# Altium project Aud.PrjPcb
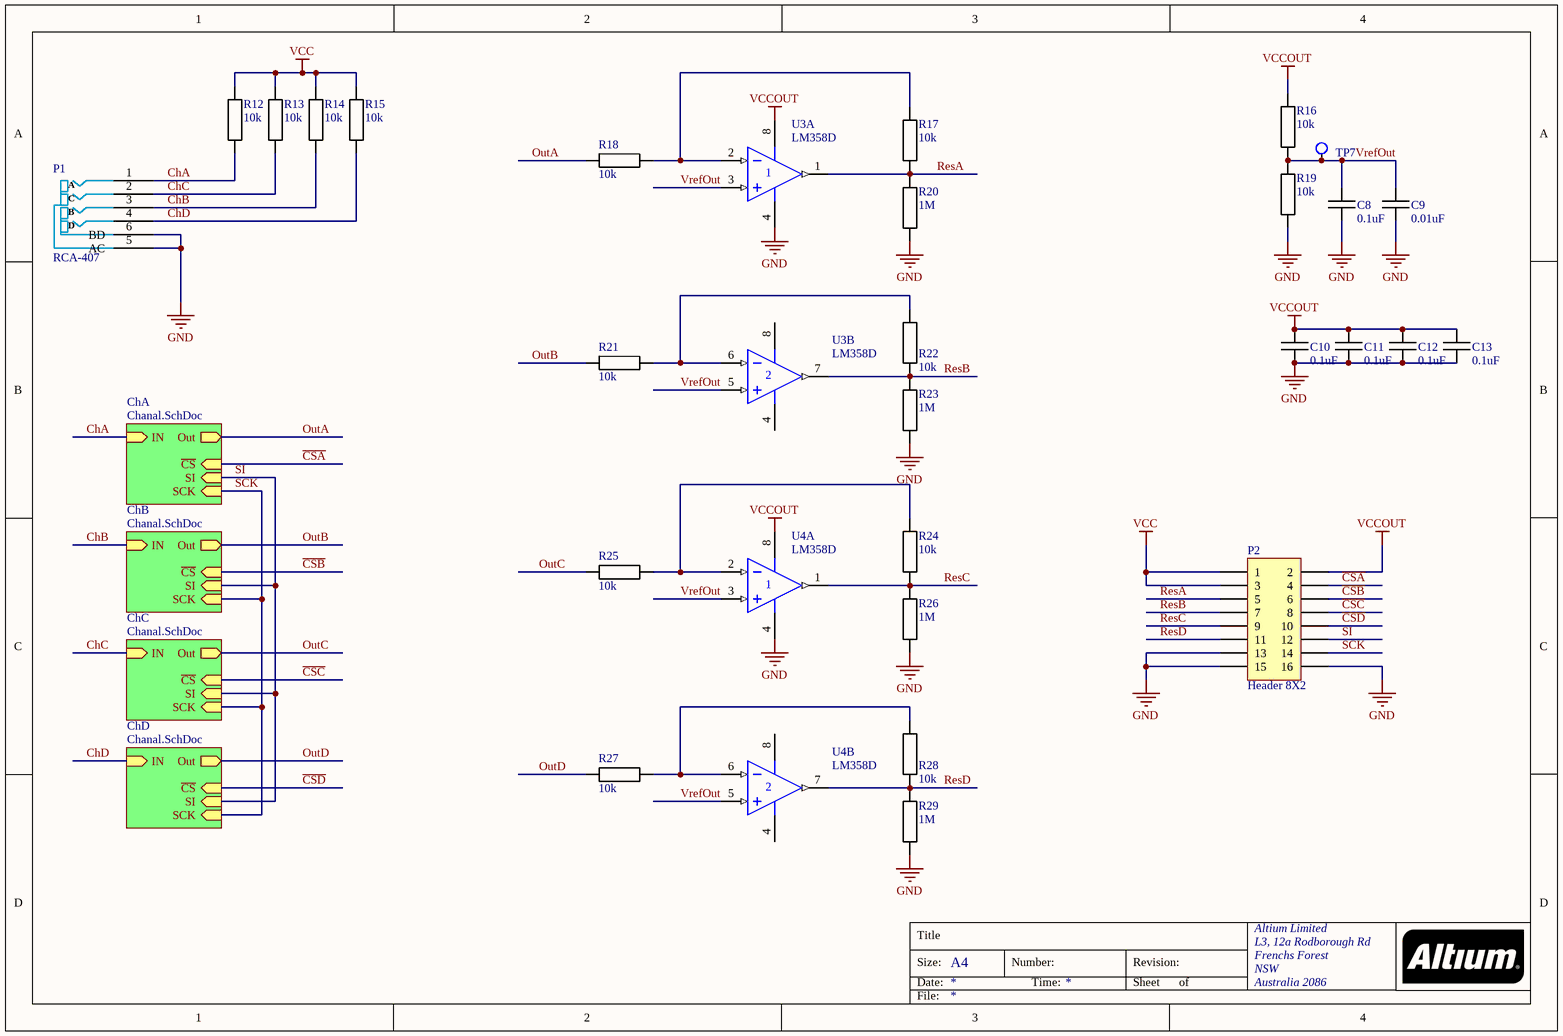
[diagram p0: Input.SchDoc]
2 sheets, 133 parts. Net scope: hierarchical (ports join the sheet entries above them; power ports are global).
Board file: AudRevA.PcbDoc
Sheets:
  Input.SchDoc
    ChA = Chanal.SchDoc
    ChB = Chanal.SchDoc
    ChC = Chanal.SchDoc
    ChD = Chanal.SchDoc

## Sheet Input.SchDoc
size A4; Organization: Altium Limited; Address1: L3, 12a Rodborough Rd; Address2: Frenchs Forest; Address3: NSW; Address4: Australia 2086

### Parts
C8  0.1uF  [SMD 0603]
C9  0.01uF  [SMD 0603]
C10  0.1uF  [SMD 0603]
C11  0.1uF  [SMD 0603]
C12  0.1uF  [SMD 0603]
C13  0.1uF  [SMD 0603]
P1  RCA-407  [RCA4]
P2  Header 8X2  [HDR2X8]
R12  10k  [SMD 0603]
R13  10k  [SMD 0603]
R14  10k  [SMD 0603]
R15  10k  [SMD 0603]
R16  10k  [SMD 0603]
R17  10k  [SMD 0603]
R18  10k  [SMD 0603]
R19  10k  [SMD 0603]
R20  1M  [SMD 0603]
R21  10k  [SMD 0603]
R22  10k  [SMD 0603]
R23  1M  [SMD 0603]
R24  10k  [SMD 0603]
R25  10k  [SMD 0603]
R26  1M  [SMD 0603]
R27  10k  [SMD 0603]
R28  10k  [SMD 0603]
R29  1M  [SMD 0603]
TP7  testPoint  [TESTPOINT]  (value not drawn)
U3  LM358D  [751-02_N]  (parts A,B of 2)
U4  LM358D  [751-02_N]  (parts A,B of 2)

### Sub-sheets
ChA = Chanal.SchDoc: ~{CS} (in), SCK (in), SI (in), IN (in), Out (out)
ChB = Chanal.SchDoc: ~{CS} (in), SCK (in), SI (in), IN (in), Out (out)
ChC = Chanal.SchDoc: ~{CS} (in), SCK (in), SI (in), IN (in), Out (out)
ChD = Chanal.SchDoc: ~{CS} (in), SCK (in), SI (in), IN (in), Out (out)

### Nets
GND: C8.2 C9.2 C10.2 C11.2 C12.2 C13.2 P1.5(AC) P1.6(BD) P2.13 P2.15 P2.16 R19.1 R20.2 R23.2 R26.2 R29.2 U3.4(V-) U4.4(V-)
VCC: P2.1 P2.3 R12.2 R13.2 R14.2 R15.2
VCCOUT: C10.1 C11.1 C12.1 C13.1 P2.2 R16.2 U3.8(V+) U4.8(V+)
~{CSA}: P2.4 ; sheet ChA/~{CS}  [project net ~{CS}]
~{CSB}: P2.6 ; sheet ChB/~{CS}  [project net ~{CS}]
~{CSC}: P2.8 ; sheet ChC/~{CS}  [project net ~{CS}]
~{CSD}: P2.10 ; sheet ChD/~{CS}  [project net ~{CS}]
ChA: P1.1(A) R12.1 ; sheet ChA/IN
ChB: P1.3(B) R14.1 ; sheet ChB/IN
ChC: P1.2(C) R13.1 ; sheet ChC/IN
ChD: P1.4(D) R15.1 ; sheet ChD/IN
OutA: R18.2 ; sheet ChA/Out
OutB: R21.2 ; sheet ChB/Out
OutC: R25.2 ; sheet ChC/Out
OutD: R27.2 ; sheet ChD/Out
ResA: P2.5 R17.2 R20.1 U3.1(OUT)
ResB: P2.7 R22.2 R23.1 U3.7(OUT)
ResC: P2.9 R24.2 R26.1 U4.1(OUT)
ResD: P2.11 R28.2 R29.1 U4.7(OUT)
SCK: P2.14 ; sheet ChA/SCK, sheet ChB/SCK, sheet ChC/SCK, sheet ChD/SCK
SI: P2.12 ; sheet ChA/SI, sheet ChB/SI, sheet ChC/SI, sheet ChD/SI
VrefOut: C8.1 C9.1 R16.1 R19.2 TP7.0 U3.3(IN+) U3.5(IN+) U4.3(IN+) U4.5(IN+)
NetR17_1: R17.1 R18.1 U3.2(IN-)
NetR21_1: R21.1 R22.1 U3.6(IN-)
NetR24_1: R24.1 R25.1 U4.2(IN-)
NetR27_1: R27.1 R28.1 U4.6(IN-)

### Notes on the sheet
- Title
- Size:
- Date:
- A4
- Number:
- Time:
- Revision:
- Sheet
- of
- File:

### Library data of the parts
C8-C13 = Capasitor
  C8 C10-C13: Value: 0.1uF
  C9: Value: 0.01uF
P1 = RCA-407: RCA 2x2
P2 = Header 8X2: Header, 8-Pin, Dual row; LatestRevisionDate: 17-Jul-2002; LatestRevisionNote: Re-released for DXP Platform.; Publisher: Altium Limited
R12-R29 = Resistor
  R12-R19 R21 R22 R24 R25 R27 R28: Value: 10k
  R20 R23 R26 R29: Value: 1M
U3 U4 = LM358D: Dual Low-Power Operational Amplifier; Published: 17-Jul-2002; LatestRevisionDate: 13-Apr-2006; LatestRevisionNote: IPC-7351 Footprint Added.; DatasheetVersion: 1988; PackageReference: 751-02; Publisher: Altium Limited; PackageDescription: 8-Pin Small Outline Integrated Circuit 1.27 mm Pitch; Code_JEDEC: MS-012-AA; Code_IPC: SOIC127P600-8; ComponentLink1Description: Manufacturer Link; ComponentLink1URL: http://www.onsemi.com/site/products/parametrics/0,4446,251,00.html; ComponentLink2Description: Datasheet; ComponentLink2URL: http://www.onsemi.com/pub/Collateral/LM358-D.PDF

## Sheet Chanal.SchDoc
size A4; Organization: Altium Limited; Address1: L3, 12a Rodborough Rd; Address2: Frenchs Forest; Address3: NSW; Address4: Australia 2086
Used 4 times, as channels ChA, ChB, ChC, ChD. Parts and nets are listed once, with the designators drawn on the sheet.
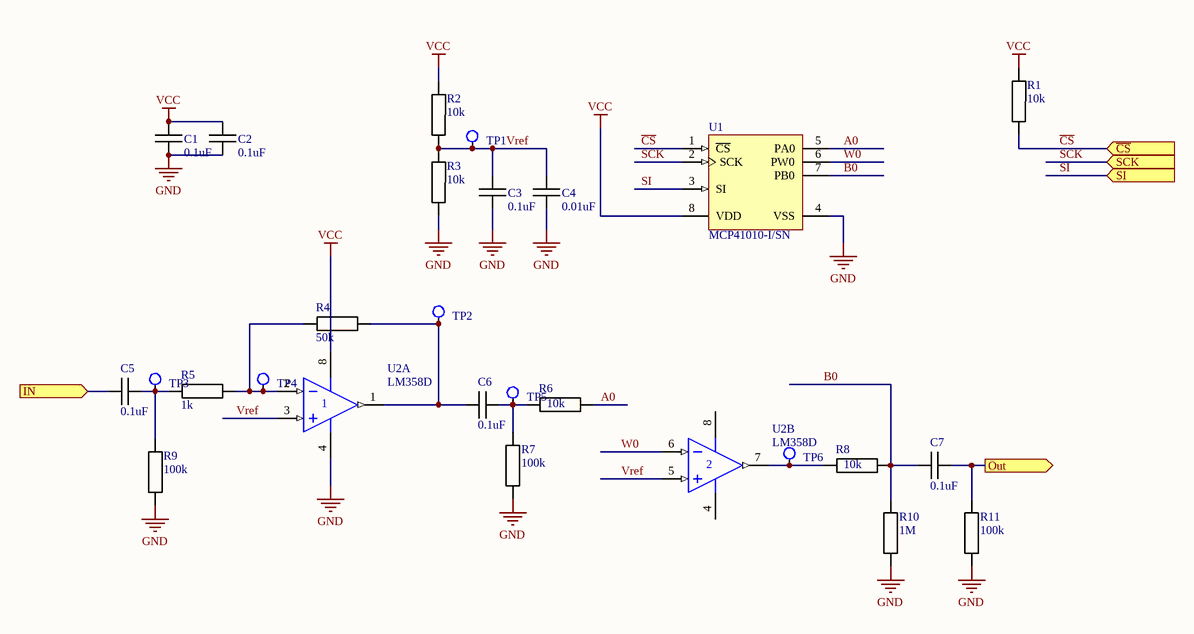
[diagram p1: Chanal.SchDoc]

### Parts
C1  0.1uF  [SMD 0603]
C2  0.1uF  [SMD 0603]
C3  0.1uF  [SMD 0603]
C4  0.01uF  [SMD 0603]
C5  0.1uF  [SMD 0603]
C6  0.1uF  [SMD 0603]
C7  0.1uF  [SMD 0603]
R1  10k  [SMD 0603]
R2  10k  [SMD 0603]
R3  10k  [SMD 0603]
R4  50k  [SMD 0603]
R5  1k  [SMD 0603]
R6  10k  [SMD 0603]
R7  100k  [SMD 0603]
R8  10k  [SMD 0603]
R9  100k  [SMD 0603]
R10  1M  [SMD 0603]
R11  100k  [SMD 0603]
TP1  testPoint  [TESTPOINT]  (value not drawn)
TP2  testPoint  [TESTPOINT]  (value not drawn)
TP3  testPoint  [TESTPOINT]  (value not drawn)
TP4  testPoint  [TESTPOINT]  (value not drawn)
TP5  testPoint  [TESTPOINT]  (value not drawn)
TP6  testPoint  [TESTPOINT]  (value not drawn)
U1  MCP41010-I/SN  [SOIC-SN8_N]
U2  LM358D  [751-02_N]  (parts A,B of 2)

### Ports
IN (in), Out (out), SCK (in), SI (in), ~{CS} (in)

### Nets
GND: C1.2 C2.2 C3.2 C4.2 R3.1 R7.2 R9.2 R10.2 R11.2 U1.4(VSS) U2.4(V-)
VCC: C1.1 C2.1 R1.2 R2.2 U1.8(VDD) U2.8(V+)
~{CS}: R1.1 U1.1(~{CS}) ; port ~{CS}
A0: R6.1 U1.5(PA0)
B0: C7.1 R8.1 R10.1 U1.7(PB0)
IN: C5.1 ; port IN
Out: C7.2 R11.1 ; port Out
SCK: U1.2(SCK) ; port SCK
SI: U1.3(SI) ; port SI
Vref: C3.1 C4.1 R2.1 R3.2 TP1.0 U2.3(IN+) U2.5(IN+)
W0: U1.6(PW0) U2.6(IN-)
NetC5_2: C5.2 R5.2 R9.1 TP3.0
NetC6_1: C6.1 R4.1 TP2.0 U2.1(OUT)
NetC6_2: C6.2 R6.2 R7.1 TP5.0
NetR4_2: R4.2 R5.1 TP4.0 U2.2(IN-)
NetR8_2: R8.2 TP6.0 U2.7(OUT)

### Channels
ChA: designators end in .A; ports IN=ChA Out=OutA SCK=SCK SI=SI ~{CS}=~{CS}
ChB: designators end in .B; ports IN=ChB Out=OutB SCK=SCK SI=SI ~{CS}=~{CS}
ChC: designators end in .C; ports IN=ChC Out=OutC SCK=SCK SI=SI ~{CS}=~{CS}
ChD: designators end in .D; ports IN=ChD Out=OutD SCK=SCK SI=SI ~{CS}=~{CS}

### Notes on the sheet
- Title
- Size:
- Date:
- A4
- Number:
- Time:
- Revision:
- Sheet
- of
- File:

### Library data of the parts
C1-C7 = Capasitor
  C1-C3 C5-C7: Value: 0.1uF
  C4: Value: 0.01uF
R1-R11 = Resistor
  R1-R3 R6 R8: Value: 10k
  R4: Value: 50k
  R5: Value: 1k
  R7 R9 R11: Value: 100k
  R10: Value: 1M
U1 = MCP41010-I/SN: Single/Dual Digital Potentiometer with SPI Interface, 8-Pin SOIC 150mil, Industrial Temperature; Manufacturer: Microchip; DatasheetVersion: Jul-2003; PackageVersion: revBB, Aug-2009; PackageReference: SOIC-SN8; PackageDescription: 8-Lead Plastic Small Outline (SN) - Narrow, 3.90mm Body [SOIC]; Supplier 1: Digi-Key; Supplier Part Number 1: MCP41010-I/SN-ND; Supplier 2: Farnell; Supplier Part Number 2: 9758607; Supplier 3: Newark; Supplier Part Number 3: 61K2949; Supplier 4: Mouser; Supplier Part Number 4: 579-MCP41010-I/SN; Mounting Technology: Surface Mount; Code_JEDEC: MS-012; Code_IPC: SOIC127P600-8; PartNumber: MCP41010-I/SN; ComponentLink1Description: Manufacturer URL; ComponentLink1URL: http://www.microchip.com/; ComponentLink2Description: Datasheet; ComponentLink2URL: http://ww1.microchip.com/downloads/en/DeviceDoc/11195c.pdf; ComponentLink3Description: Package Specification; ComponentLink3URL: http://www.microchip.com/stellent/groups/techpub_sg/documents/packagingspec/en012702.pdf
U2 = LM358D: Dual Low-Power Operational Amplifier; Published: 17-Jul-2002; LatestRevisionDate: 13-Apr-2006; LatestRevisionNote: IPC-7351 Footprint Added.; DatasheetVersion: 1988; PackageReference: 751-02; Publisher: Altium Limited; PackageDescription: 8-Pin Small Outline Integrated Circuit 1.27 mm Pitch; Code_JEDEC: MS-012-AA; Code_IPC: SOIC127P600-8; ComponentLink1Description: Manufacturer Link; ComponentLink1URL: http://www.onsemi.com/site/products/parametrics/0,4446,251,00.html; ComponentLink2Description: Datasheet; ComponentLink2URL: http://www.onsemi.com/pub/Collateral/LM358-D.PDF

## Nets that join several sheets
GND: Input (18 pins), ChA (11 pins), ChB (11 pins), ChC (11 pins), ChD (11 pins)
VCC: Input (6 pins), ChA (6 pins), ChB (6 pins), ChC (6 pins), ChD (6 pins)
~{CS}: Input (P2.4), ChA (R1.A.1 U1.A.1)
~{CS}: Input (P2.6), ChB (R1.B.1 U1.B.1)
~{CS}: Input (P2.8), ChC (R1.C.1 U1.C.1)
~{CS}: Input (P2.10), ChD (R1.D.1 U1.D.1)
ChA: Input (P1.1 R12.1), ChA (C5.A.1)
ChB: Input (P1.3 R14.1), ChB (C5.B.1)
ChC: Input (P1.2 R13.1), ChC (C5.C.1)
ChD: Input (P1.4 R15.1), ChD (C5.D.1)
OutA: Input (R18.2), ChA (C7.A.2 R11.A.1)
OutB: Input (R21.2), ChB (C7.B.2 R11.B.1)
OutC: Input (R25.2), ChC (C7.C.2 R11.C.1)
OutD: Input (R27.2), ChD (C7.D.2 R11.D.1)
SCK: Input (P2.14), ChA (U1.A.2), ChB (U1.B.2), ChC (U1.C.2), ChD (U1.D.2)
SI: Input (P2.12), ChA (U1.A.3), ChB (U1.B.3), ChC (U1.C.3), ChD (U1.D.3)